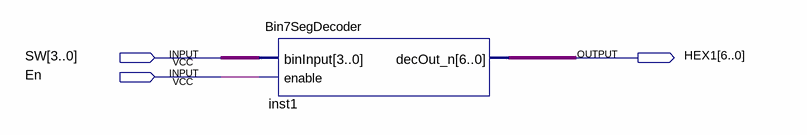
[diagram p0: schematic sheet]
// Quartus schematic DisplayDemo.bdf as structural Verilog: 1 symbols, 3 pins
module DisplayDemo (
  input  [3:0] SW,
  input  En,
  output [6:0] HEX1
);

  Bin7SegDecoder inst1 (.binInput(SW), .enable(En), .decOut_n(HEX1));
endmodule
